# Altium schematic sheet Acondicionamiento_Presion.SchDoc: Modulo de Acondicionamiento de Presion
size A4; Date: 09/2013; Author: Roux, Federico G.; CompanyName: UF; Engineer: Roux, Federico G. (rouxfederico@gmail.com); Organization: UF; Address1: rouxfederico@gmail.com; Revision: 1.0; DocumentName: Acondicionamiento_Presion; ProjectName: Pres24 (Módulos); Rule: PcbType=ProtelPcb
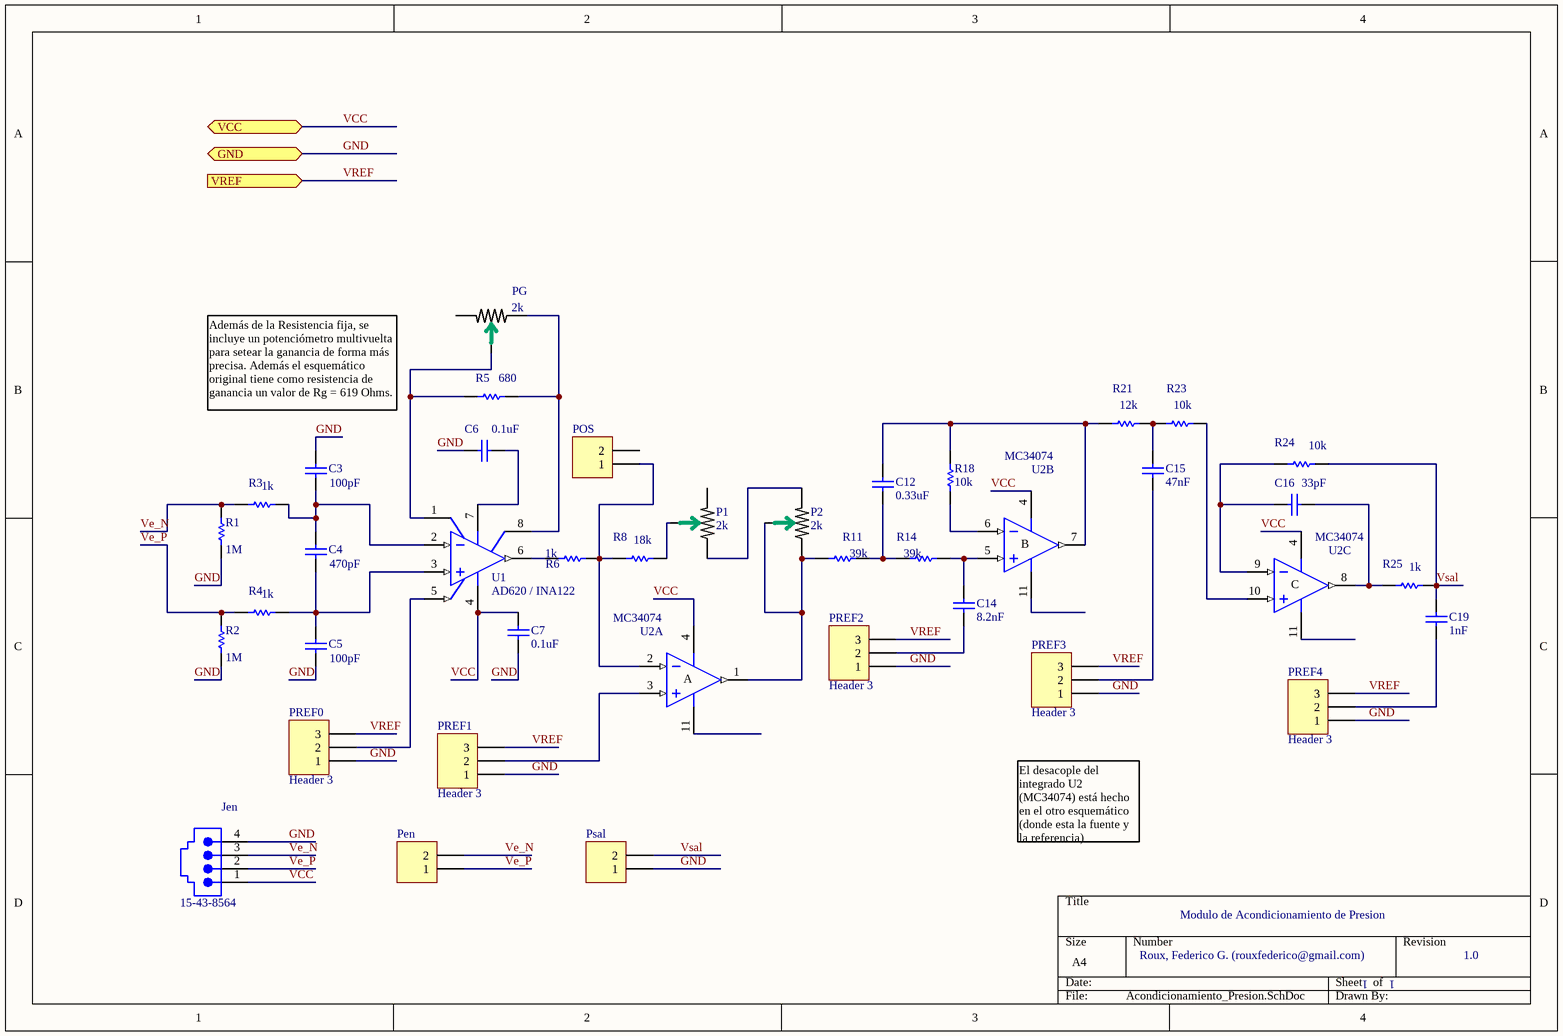
[diagram p0: Acondicionamiento_Presion.SchDoc]

## Parts
C3  value 100pF  [6-0805_M]  (hidden comment: Cap)
C4  value 470pF  [6-0805_M]  (hidden comment: Cap)
C5  value 100pF  [6-0805_M]  (hidden comment: Cap)
C6  value 0.1uF  [6-0805_M]  (hidden comment: Cap)
C7  value 0.1uF  [6-0805_M]  (hidden comment: Cap)
C12  value 0.33uF  [6-0805_M]  (hidden comment: Cap)
C14  value 8.2nF  [6-0805_M]  (hidden comment: Cap)
C15  value 47nF  [6-0805_M]  (hidden comment: Cap)
C16  value 33pF  [6-0805_M]  (hidden comment: Cap)
C19  value 1nF  [6-0805_M]  (hidden comment: Cap)
Jen  15-43-8564  [15-43-8564]
P1  value 2k  [Preset Largo]  (hidden comment: Preset)
P2  value 2k  [Preset Largo]  (hidden comment: Preset)
Pen  Header 2  [HDR1X2]  (value not drawn)
PG  value 2k  [Preset Largo]  (hidden comment: Preset)
POS  Header 2  [HDR1X2]  (value not drawn)
PREF0  Header 3  [HDR1X3]
PREF1  Header 3  [HDR1X3]
PREF2  Header 3  [HDR1X3]
PREF3  Header 3  [HDR1X3]
PREF4  Header 3  [HDR1X3]
Psal  Header 2  [HDR1X2]  (value not drawn)
R1  value 1M  [6-0805_L]  (hidden comment: Res1)
R2  value 1M  [6-0805_L]  (hidden comment: Res1)
R3  value 1k  [6-0805_L]  (hidden comment: Res1)
R4  value 1k  [6-0805_L]  (hidden comment: Res1)
R5  value 680  [6-0805_L]  (hidden comment: Res1)
R6  value 1k  [6-0805_L]  (hidden comment: Res1)
R8  value 18k  [6-0805_L]  (hidden comment: Res1)
R11  value 39k  [6-0805_L]  (hidden comment: Res1)
R14  value 39k  [6-0805_L]  (hidden comment: Res1)
R18  value 10k  [6-0805_L]  (hidden comment: Res1)
R21  value 12k  [6-0805_L]  (hidden comment: Res1)
R23  value 10k  [6-0805_L]  (hidden comment: Res1)
R24  value 10k  [6-0805_L]  (hidden comment: Res1)
R25  value 1k  [6-0805_L]  (hidden comment: Res1)
U1  AD620 / INA122  [N-8]
U2  MC34074  [Q-14]  (parts A,B,C of 4)

## Ports
GND, VCC, VREF (in)

## Nets
GND: C3.2 C5.1 C6.2 C7.2 Jen.4 PREF0.1 PREF1.1 PREF2.1 PREF3.1 PREF4.1 Psal.1 R1.1 R2.1 ; port GND
VCC: C7.1 Jen.1 U1.4(V-) U2.4(V+) ; port VCC
Ve_N: Jen.3 Pen.2 R1.2 R3.2
Ve_P: Jen.2 Pen.1 R2.2 R4.2
VREF: PREF0.3 PREF1.3 PREF2.3 PREF3.3 PREF4.3 ; port VREF
Vsal: C19.1 Psal.2 R24.1 R25.1
NetC3_1: C3.1 C4.2 R3.1 U1.2(-IN)
NetC4_1: C4.1 C5.2 R4.1 U1.3(+IN)
NetC6_1: C6.1 U1.7(V+)
NetC12_1: C12.1 R18.1 R21.2 U2.7(OUT)
NetC12_2: C12.2 R11.1 R14.2
NetC14_1: C14.1 R14.1 U2.5(IN+)
NetC14_2: C14.2 PREF2.2
NetC15_1: C15.1 R21.1 R23.2
NetC15_2: C15.2 PREF3.2
NetC16_1: C16.1 R25.2 U2.8(OUT)
NetC16_2: C16.2 R24.2 U2.9(IN-)
NetC19_2: C19.2 PREF4.2
NetP1_1: P1.1(CCW) P2.3(CW)
NetP1_2: P1.2(WLPER) R8.1
NetP2_1: P2.1(CCW) P2.2(WLPER) R11.2 U2.1(OUT)
NetPG_1: PG.1(CCW) R5.1 U1.8(RG)
NetPG_2: PG.2(WLPER) R5.2 U1.1(RG)
NetPOS_1: POS.1 R6.1 R8.2 U2.2(IN-)
NetPREF0_2: PREF0.2 U1.5(REF)
NetPREF1_2: PREF1.2 U2.3(IN+)
NetR6_2: R6.2 U1.6(OUT)
NetR18_2: R18.2 U2.6(IN-)
NetR23_1: R23.1 U2.10(IN+)

Not connected (* = marked no-connect by the designer): P1 3(CW); PG 3(CW); POS 2; U2 11(V-)

## Notes on the sheet
- Además de la Resistencia fija, se incluye un potenciómetro multivuelta para setear la ganancia de forma más precisa. Además el esquemático original tiene como resistencia de ganancia un valor de Rg = 619 Ohms.
- El desacople del integrado U2 (MC34074) está hecho en el otro esquemático (donde esta la fuente y la referencia)
- 1
- (in symbol AD713BQ, part A) A
- (in symbol AD713BQ, part B) B
- (in symbol AD713BQ, part C) C

## Library data of the parts
C3-C7 C12 C14-C16 C19 = Cap: Capacitor; Published: 8-Jun-2000; LatestRevisionDate: 17-Jul-2002; LatestRevisionNote: Re-released for DXP Platform.; PackageReference: RAD-0.3; Publisher: Altium Limited; PackageDescription: Radial Cap, Thru-Hole; 2 Leads; 0.3 in Pin Spacing
Jen = 15-43-8564: Right Angle, Standard Profile, Unshielded PCB Jack; Ports: 1; Positions/Loaded: Port1 - 6/4; PerformanceCategory: 3; PCB_Mounting: Thru-Hole; DrillSize: Nominal, Rounded to nearest 0.05mm; PCB_Layout: Complies with Manufacturer's Recommendation.; Published: 25-Jun-2002; DatasheetDocument: 18-Dec-2001; PackageDocument: 18-Dec-2001; PackageReference: 15-43-8564; Publisher: Altium Limited; ComponentLink1Description: Manufacturer Link; ComponentLink1URL: http://www.molex.com/; ComponentLink2Description: Datasheet; ComponentLink2URL: http://www.molex.com/cmc_upload/common_files/1212003_41687catalogpage.pdf; ComponentLink3Description: Iges Model; ComponentLink3URL: http://www.molex.com/pdm_docs/igs/15-43-8501_igs.zip
P1 P2 PG = Preset Multivuelta: Rectangular/Multiturn/Trimming Potentiometer; DB LECTRO Inc.: Fabricante; Autor: Roux, Federico G.; Mail: froux@favaloro.edu.ar; Empresa: Universidad Favaloro
Pen POS Psal = Header 2: Header, 2-Pin; LatestRevisionDate: 17-Jul-2002; LatestRevisionNote: Re-released for DXP Platform.; Publisher: Altium Limited
PREF0-PREF4 = Header 3: Header, 3-Pin; LatestRevisionDate: 17-Jul-2002; LatestRevisionNote: Re-released for DXP Platform.; Publisher: Altium Limited
R1-R6 R8 R11 R14 R18 R21 R23-R25 = Res1: Resistor; Published: 8-Jun-2000; LatestRevisionDate: 17-Jul-2002; LatestRevisionNote: Re-released for DXP Platform.; PackageReference: AXIAL-0.3; Publisher: Altium Limited; PackageDescription: Axial Device, Thru-Hole; 2 Leads; 0.3 in Pin Spacing
U1 = AD620BN: Low-Cost, Low-Power Instrumentation Amplifier; Published: 8-Jun-2000; LatestRevisionDate: 04-Mar-2005; LatestRevisionNote: Stylized 3D Model Added.; DatasheetVersion: REV.D 1998; PackageVersion: revA; PackageReference: N-8; Publisher: Altium Limited; PackageDescription: DIP; 8 Leads; Row Spacing 7.62 mm; Pitch 2.54 mm; ComponentLink1Description: Manufacturer Link; ComponentLink1URL: http://www.analog.com/en/prod/0%2C2877%2CAD620%2C00.html; ComponentLink2Description: Datasheet; ComponentLink2URL: http://www.analog.com/UploadedFiles/Data_Sheets/897653854AD620_g.pdf
U2 = AD713BQ: Quad Precision Low Cost High-Speed BiFET Operational Amplifier; Published: 8-Jun-2000; LatestRevisionDate: 04-Mar-2005; LatestRevisionNote: Stylized 3D Model Added.; DatasheetVersion: REV. B; PackageVersion: revB; PackageReference: Q-14; Publisher: Altium Limited; PackageDescription: DIP; 14 Leads; Row Spacing 7.62 mm; Pitch 2.54 mm; ComponentLink1Description: Manufacturer Link; ComponentLink1URL: http://www.analog.com/en/prod/0,,759_786_AD713%2C00.html; ComponentLink2Description: Datasheet; ComponentLink2URL: http://www.analog.com/UploadedFiles/Data_Sheets/70859332AD713_c.pdf